# Altium project Flow_Pump.PrjPcb
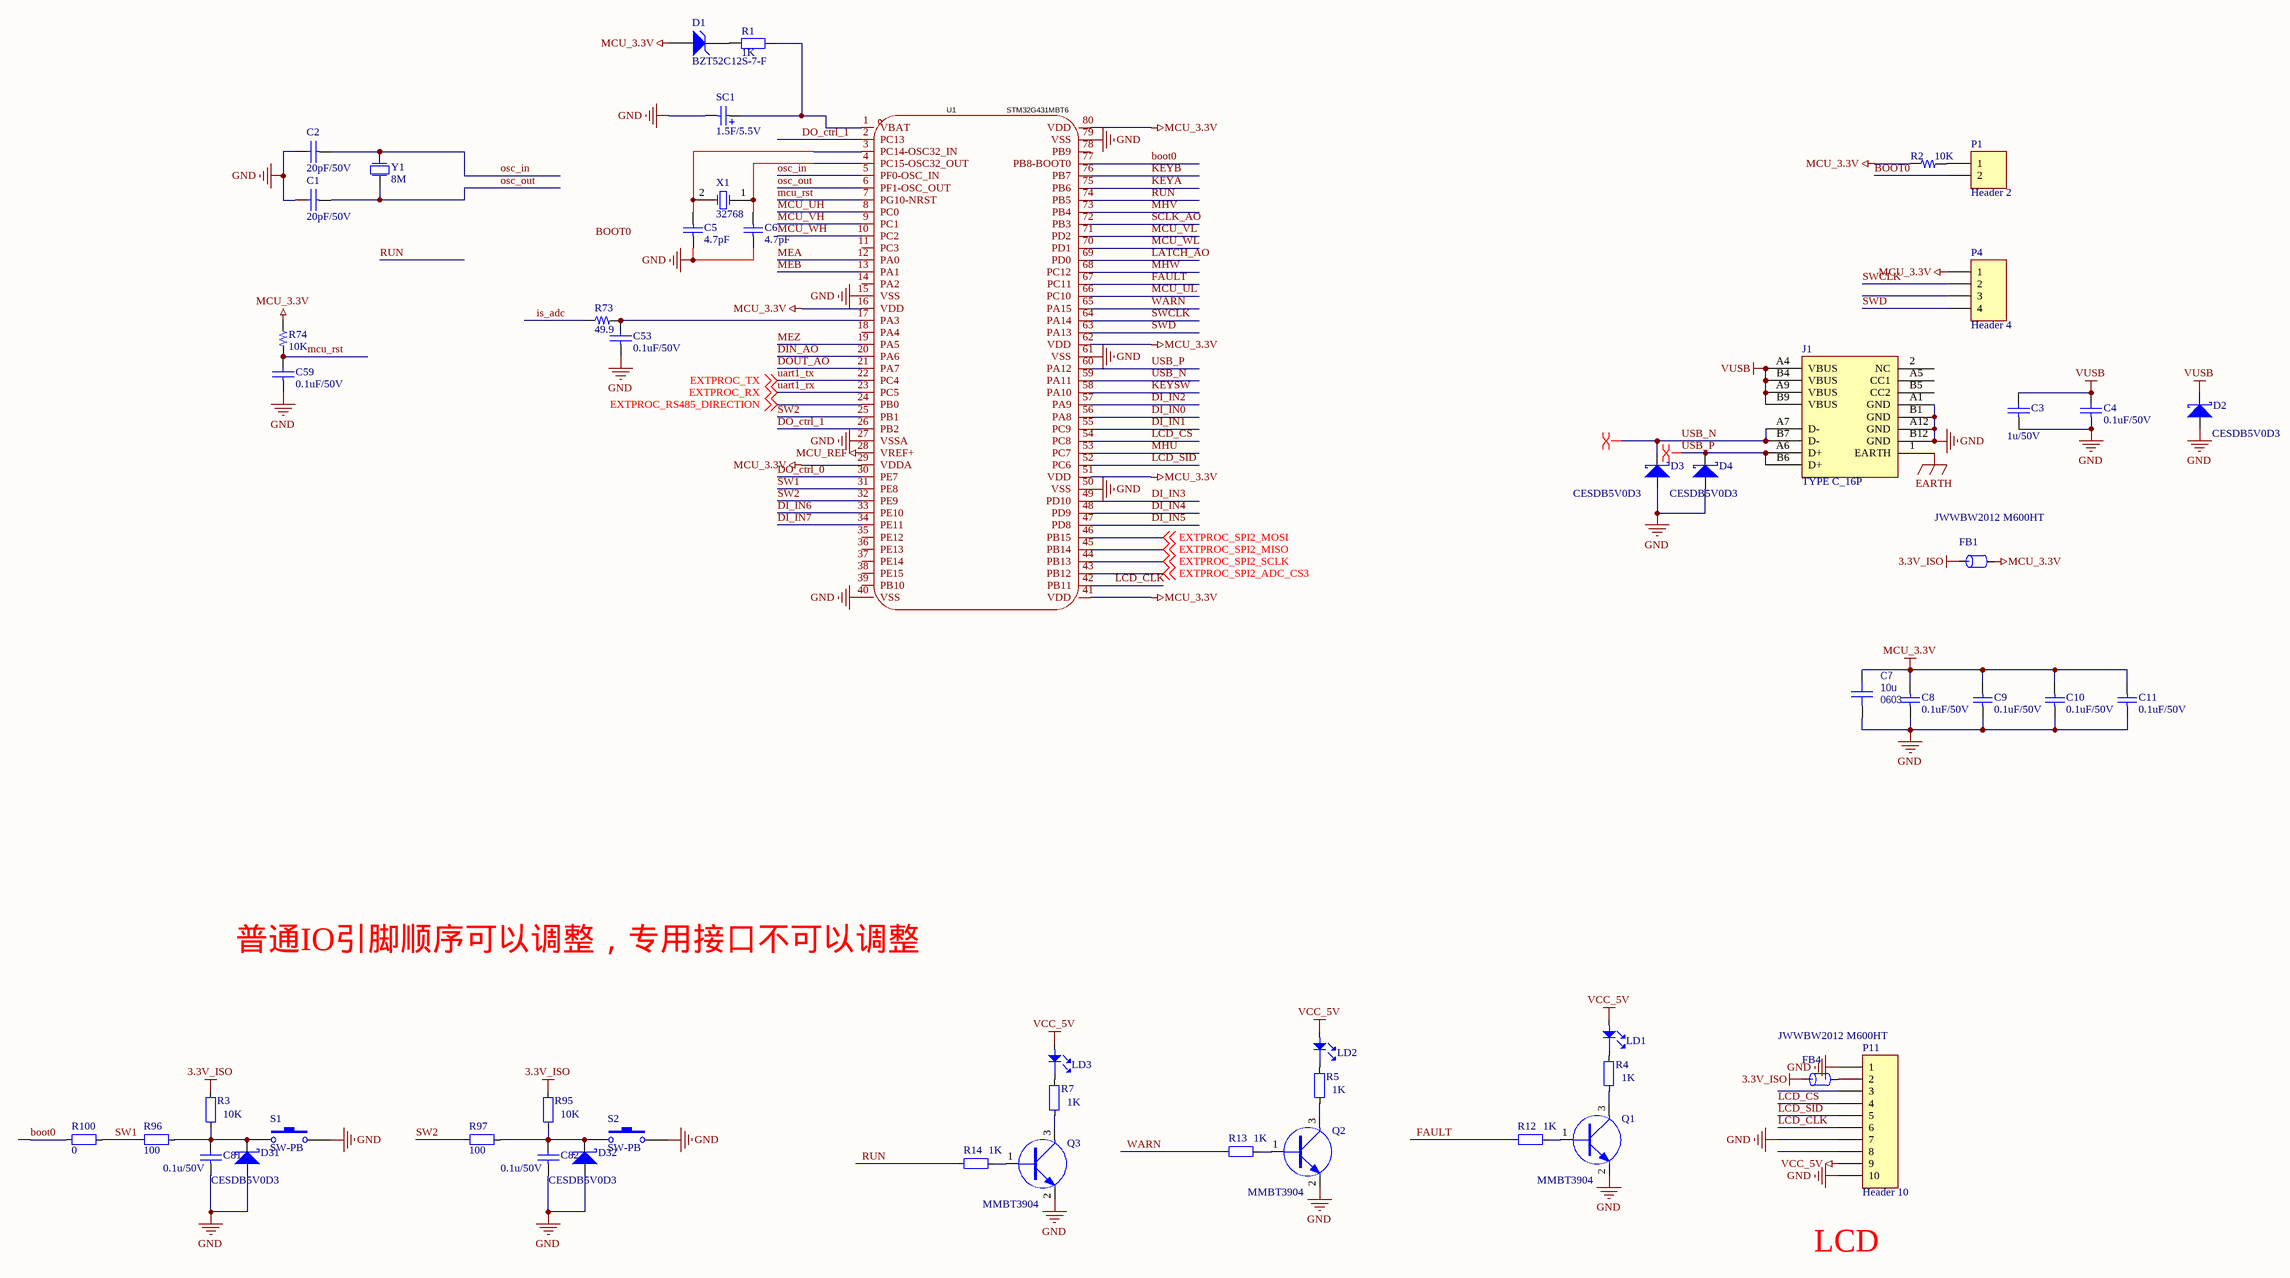
[diagram p0: mcu.SchDoc]
5 sheets, 247 parts. Net scope: global (net labels, ports and power ports of the same name join across sheets).
Board file: PCB1.PcbDoc
Sheets:
  mcu.SchDoc
  ai.SchDoc
  DI_DO.SchDoc
  sensor.SchDoc
  power.SchDoc

## Sheet mcu.SchDoc
size A2; SheetNumber: 1; SheetTotal: 4

### Parts
C1  value 20pF/50V  [0603C]  (hidden comment: 20pF/25V)
C2  value 20pF/50V  [0603C]  (hidden comment: 20pF/25V)
C3  value 1u/50V  [0603C]  (hidden comment: 1uF/25V)
C4  0.1uF/50V  [0603C]
C5  4.7pF  [0603C]
C6  4.7pF  [0603C]
C7  value 10u  Package: 0603  [CAPC1608X092N_0603]  (hidden comment: Capacitor_0603)
C8  0.1uF/50V  [0603C]
C9  0.1uF/50V  [0603C]
C10  0.1uF/50V  [0603C]
C11  0.1uF/50V  [0603C]
C53  0.1uF/50V  [0603C]
C59  0.1uF/50V  [0603C]
C81  value 0.1u/50V  [0603C]  (hidden comment: 1uF/25V)
C82  value 0.1u/50V  [0603C]  (hidden comment: 1uF/25V)
D1  BZT52C12S-7-F  [DIOD-SOD323-2_V]
D2  CESDB5V0D3  [SOD323]
D3  CESDB5V0D3  [SOD323]
D4  CESDB5V0D3  [SOD323]
D31  CESDB5V0D3  [SOD323]
D32  CESDB5V0D3  [SOD323]
FB1  JWWBW2012 M600HT  [0805R]
FB4  JWWBW2012 M600HT  [0805R]
J1  TYPE C_16P  [TYPEC_16P]
LD1  LED_Green_19-217  [0603led]  (value not drawn)
LD2  LED_Green_19-217  [0603led]  (value not drawn)
LD3  LED_Green_19-217  [0603led]  (value not drawn)
P1  Header 2  [HDR1X2]
P4  Header 4  [HDR1X4]
P11  Header 10  [HDR1X10]
Q1  MMBT3904  [SOT23-3]
Q2  MMBT3904  [SOT23-3]
Q3  MMBT3904  [SOT23-3]
R1  1K  [0603R]  (no BOM)
R2  10K  [0603R]
R3  10K  [0603r]
R4  1K  [0603r]
R5  1K  [0603r]
R7  1K  [0603r]
R12  1K  [0603r]
R13  1K  [0603r]
R14  1K  [0603r]
R73  49.9  [0603R]
R74  10K  [0603R]
R95  10K  [0603r]
R96  100  [0603r]
R97  100  [0603r]
R100  0  [0603r]
S1  SW-PB  [SPST-2]
S2  SW-PB  [SPST-2]
SC1  1.5F/5.5V  [CAP-TH_DMS3R3224]
U1  STM32G431MBT6  [LQFP-80_L12.0-W12.0-P0.50-BL-EP]
X1  32768  [A]
Y1  8M  [CRAY_5032]

### Nets
3.3V_ISO: FB1.1 FB4.1 R3.1 R95.1
EARTH: J1.1(EARTH)
GND: C1.2 C2.2 C3.1 C4.1 C5.2 C6.2 C7.2 C8.1 C9.1 C10.1 C11.1 C53.1 C59.1 C81.1 C82.1 D2.1(A) D3.1(A) D4.1(A) D31.1(A) D32.1(A) J1.A1(GND) J1.A12(GND) J1.B1(GND) J1.B12(GND) P11.1 P11.7 P11.10 Q1.2(E) Q2.2(E) Q3.2(E) S1.2 S2.2 SC1.2 U1.15(VSS) U1.27(VSSA) U1.40(VSS) U1.50(VSS) U1.61(VSS) U1.79(VSS)
MCU_3.3V: C7.1 C8.2 C9.2 C10.2 C11.2 D1.1(A) FB1.2 P4.1 R2.1 R74.1 U1.16(VDD) U1.29(VDDA) U1.41(VDD) U1.51(VDD) U1.62(VDD) U1.80(VDD)
MCU_REF: U1.28(VREF+)
VCC_5V: LD1.1 LD2.1 LD3.1 P11.9
VUSB: C3.2 C4.2 D2.2(K) J1.A4(VBUS) J1.A9(VBUS) J1.B4(VBUS) J1.B9(VBUS)
BOOT0: P1.2 R100.1 U1.77(PB8-BOOT0)
DI_IN0: U1.56(PA8)
DI_IN1: U1.55(PC9)
DI_IN2: U1.57(PA9)
DI_IN3: U1.49(PD10)
DI_IN4: U1.48(PD9)
DI_IN5: U1.47(PD8)
DI_IN6: U1.33(PE10)
DI_IN7: U1.34(PE11)
DIN_AO: U1.20(PA6)
DO_ctrl_0: U1.30(PE7)
DO_ctrl_1: U1.2(PC13) U1.26(PB2)
DOUT_AO: U1.21(PA7)
EXTPROC_RS485_DIRECTION: U1.24(PB0) ; off-sheet EXTPROC_RS485_DIRECTION
EXTPROC_SPI2_ADC_CS3: U1.43(PB12) ; off-sheet EXTPROC_SPI2_ADC_CS3
EXTPROC_SPI2_MISO: U1.45(PB14) ; off-sheet EXTPROC_SPI2_MISO
EXTPROC_SPI2_MOSI: U1.46(PB15) ; off-sheet EXTPROC_SPI2_MOSI
EXTPROC_SPI2_SCLK: U1.44(PB13) ; off-sheet EXTPROC_SPI2_SCLK
FAULT: R12.1 U1.67(PC11)
is_adc: R73.1
KEYA: U1.75(PB6)
KEYB: U1.76(PB7)
KEYSW: U1.58(PA10)
LATCH_AO: U1.69(PD0)
LCD_CLK: P11.6 U1.42(PB11)
LCD_CS: P11.4 U1.54(PC8)
LCD_SID: P11.5 U1.52(PC6)
mcu_rst: C59.2 R74.2 U1.7(PG10-NRST)
MCU_UH: U1.8(PC0)
MCU_UL: U1.66(PC10)
MCU_VH: U1.9(PC1)
MCU_VL: U1.71(PD2)
MCU_WH: U1.10(PC2)
MCU_WL: U1.70(PD1)
MEA: U1.12(PA0)
MEB: U1.13(PA1)
MEZ: U1.19(PA5)
MHU: U1.53(PC7)
MHV: U1.73(PB4)
MHW: U1.68(PC12)
osc_in: C2.1 U1.5(PF0-OSC_IN) Y1.1(P1)
osc_out: C1.1 U1.6(PF1-OSC_OUT) Y1.2(P2)
RUN: R14.1 U1.74(PB5)
SCLK_AO: U1.72(PB3)
SW1: R96.1 R100.2 U1.31(PE8)
SW2: R97.1 U1.25(PB1) U1.32(PE9)
SWCLK: P4.2 U1.64(PA14)
SWD: P4.4 U1.63(PA13)
uart1_rx: U1.23(PC5) ; off-sheet EXTPROC_RX  [also labelled EXTPROC_RX]
uart1_tx: U1.22(PC4) ; off-sheet EXTPROC_TX  [also labelled EXTPROC_TX]
USB_N: D3.2(K) J1.A7(D-) J1.B7(D-) U1.59(PA11)
USB_P: D4.2(K) J1.A6(D+) J1.B6(D+) U1.60(PA12)
WARN: R13.1 U1.65(PA15)
NetC5_1: C5.1 U1.3(PC14-OSC32_IN) X1.2(OSC2)
NetC6_1: C6.1 U1.4(PC15-OSC32_OUT) X1.1(OSC1)
NetC53_2: C53.2 R73.2 U1.17(PA3)
NetC81_2: C81.2 D31.2(K) R3.2 R96.2 S1.1
NetC82_2: C82.2 D32.2(K) R95.2 R97.2 S2.1
NetD1_2: D1.2(K) R1.1
NetFB4_2: FB4.2 P11.2
NetLD1_2: LD1.2 R4.1
NetLD2_2: LD2.2 R5.1
NetLD3_2: LD3.2 R7.1
NetP1_1: P1.1 R2.2
NetQ1_1: Q1.1(B) R12.2
NetQ1_3: Q1.3(C) R4.2
NetQ2_1: Q2.1(B) R13.2
NetQ2_3: Q2.3(C) R5.2
NetQ3_1: Q3.1(B) R14.2
NetQ3_3: Q3.3(C) R7.2
NetR1_2: R1.2 SC1.1 U1.1(VBAT)

Not connected (* = marked no-connect by the designer): J1 2(NC) A5(CC1) B5(CC2); P4 3; P11 3 8; U1 11(PC3) 14(PA2) 18(PA4) 35(PE12) 36(PE13) 37(PE14) 38(PE15) 39(PB10) 78(PB9)

### Layout directives
differential pair: USB_N, USB_P

### Notes on the sheet
- 普通IO引脚顺序可以调整，专用接口不可以调整
- LCD
- Labels drawn without touching a wire or pin: BOOT0

### Library data of the parts
C1-C4 C53 C59 C81 C82 = CAP
  C4 C53 C59: Value: 0.1uF/50V
C5 = Cap: Capacitor; Value: 6.8pF; Published: 8-Jun-2000; LatestRevisionDate: 17-Jul-2002; LatestRevisionNote: Re-released for DXP Platform.; PackageReference: RAD-0.3; Publisher: Altium Limited; PackageDescription: Radial Cap, Thru-Hole; 2 Leads; 0.3 in Pin Spacing
C6 = Cap: Capacitor; Published: 8-Jun-2000; LatestRevisionDate: 17-Jul-2002; LatestRevisionNote: Re-released for DXP Platform.; PackageReference: RAD-0.3; Publisher: Altium Limited; PackageDescription: Radial Cap, Thru-Hole; 2 Leads; 0.3 in Pin Spacing
C7 = Capacitor_0603: Capacitor, MLCC; Manufacturer: Murata Electronics; PartNumber: GRM188R61A106KE69D; Tolerance: [tol]; TempCo: [tempco]; Voltage Rating: [voltage]; Supplier 1: *; ComponentLink1URL: *; Supplier Part Number 1: *; ComponentLink1Description: Datasheet; SupplierDescription: CAP CER 10UF 10V X5R 0603
C8-C11 = Cap: Capacitor; Value: 22nF; Published: 8-Jun-2000; LatestRevisionDate: 17-Jul-2002; LatestRevisionNote: Re-released for DXP Platform.; PackageReference: RAD-0.3; Publisher: Altium Limited; PackageDescription: Radial Cap, Thru-Hole; 2 Leads; 0.3 in Pin Spacing
D1 = BZT52C12S-7-F: Zener Current: 5mA; Vz - Zener Voltage: 12V; Pd - Power Dissipation: 200mW; Zz - Zener Impedance: 40Ohms; Unit Weight: 0.000173oz; Voltage Temperature Coefficient: 0.25mV/C; Voltage Tolerance: 5%; Package Reference: SOD323-2; Minimum Operating Temperature: -65C; Packaging: Reel; Product Category: ZenerDiodes; Termination Style: SMD/SMT; Mounting Style: SMD/SMT; RoHS: True; Package / Case: SOD-323; Package Description: 2-Pin Surface Mount Device, Body 1.7 x 1.3 mm; Width: 1.4mm; Mounting Technology: SurfaceMount; Package URL: http://www.vishay.com/docs/71192/71192.pdf; Series: BZT52C12; Value: BZT52C12S-7-F
D2 D3 = DIODE S
D4 D31 D32 = DIODE S: Value: 0.1uF/50V
FB1 FB4 = FB: Part Field 1: 磁珠/0603/1K ohm/100MHz; FB: BLM18BD102SN1(muRata); Text Field1: FB
LD1-LD3 = LED_Green_19-217: 物料主编码(PN): 100000032; Value: 19-217/G7C-AN1P2/3T; ID: 6; 序号: 33; 物料名称: 绿色LED; 物料描述: Other,LED,绿色,0603,1.6X0.8X0.4mm,19-217/G7C-AN1P2/3T; 工作温度: –40°C to 85°C; 制造商: Everlight; 器件等级: ——; 物料类型: 特殊二极管; 规格型号(完整型号): 19-217/G7C-AN1P2/3T
P11 = Header 10: Header, 10-Pin; LatestRevisionDate: 17-Jul-2002; LatestRevisionNote: Re-released for DXP Platform.; Publisher: Altium Limited
Q1-Q3 = NPN_MMBT3904
R1 = Res0805M
R2 R73 R74 = R: Value: 10k/1%
R3 R95-R97 R100 = RES0603: 物料主编码(PN): 150000040; Value: 1K; ID: 233; 序号: 109; 物料名称: 贴片电阻; 精度: ±1%; 规格型号(完整型号): RC1608F103CS/RC0603FR-0710KL; 物料描述: RES,贴片电阻,0603,10k,±1%,1/10W,1.6X0.8X0.45mm,RC1608F103CS/RC0603FR-0710KL; 工作温度: –55°C to 155°C; 制造商: 三星/YAGEO; 器件等级: ——; 物料类型: 表贴电阻; 参数值: 1.00E+04
R4 R5 R7 R12-R14 = RES0603: 物料主编码(PN): 150000040; ID: 233; 序号: 109; 物料名称: 贴片电阻; 精度: ±1%; 规格型号(完整型号): RC1608F103CS/RC0603FR-0710KL; 物料描述: RES,贴片电阻,0603,10k,±1%,1/10W,1.6X0.8X0.45mm,RC1608F103CS/RC0603FR-0710KL; 工作温度: –55°C to 155°C; 制造商: 三星/YAGEO; 器件等级: ——; 物料类型: 表贴电阻; 参数值: 1.00E+04; Value: 1K
S1 S2 = SW-PB: Switch; Published: 24-Mar-1999; LatestRevisionDate: 17-Jul-2002; LatestRevisionNote: Re-released for DXP Platform.; PackageReference: SPST-2; Publisher: Altium Limited
SC1 = Cap Pol2: Polarized Capacitor (Axial); Value: 100pF; Published: 8-Jun-2000; LatestRevisionDate: 17-Jul-2002; LatestRevisionNote: Re-released for DXP Platform.; PackageReference: POLAR0.8; Publisher: Altium Limited
U1 = STM32G431MBT6: Add into BOM: yes; CPU Core: ARM-M4; Program Storage Size: 128KB; GPIO Ports Number: 66; Operating Voltage Range: 1.71V~3.6V; CPU Maximum Speed: 170MHz; ADC (Bit): 12bit; Symbol: STM32G431MBT6; Device: STM32G431MBT6; Supplier Part: C730099; Manufacturer: STM32G431MBT6; Manufacturer Part: STM32G431MBT6; Supplier Footprint: LQFP-80(12x12); JLCPCB Part Class: Extended Part; Datasheet: https://atta.szlcsc.com/upload/public/pdf/source/20200902/C730096_BFCD20E6BEC60EDD56B8D75B9D9F0D4C.pdf; Supplier: LCSC; Convert to PCB: yes; DAC (Bit): 12bit; Comment_1: STM32G431MBT6
X1 = XTAL: Crystal Oscillator; Published: 8-Jun-2000; LatestRevisionDate: 17-Jul-2002; LatestRevisionNote: Re-released for DXP Platform.; PackageReference: R38; Publisher: Altium Limited
Y1 = XTAL: Value: 8M
P1 = Header 2: Publisher: Altium Limited
P4 = Header 4: Publisher: Altium Limited

## Sheet ai.SchDoc
size A0; SheetNumber: 3; SheetTotal: 3
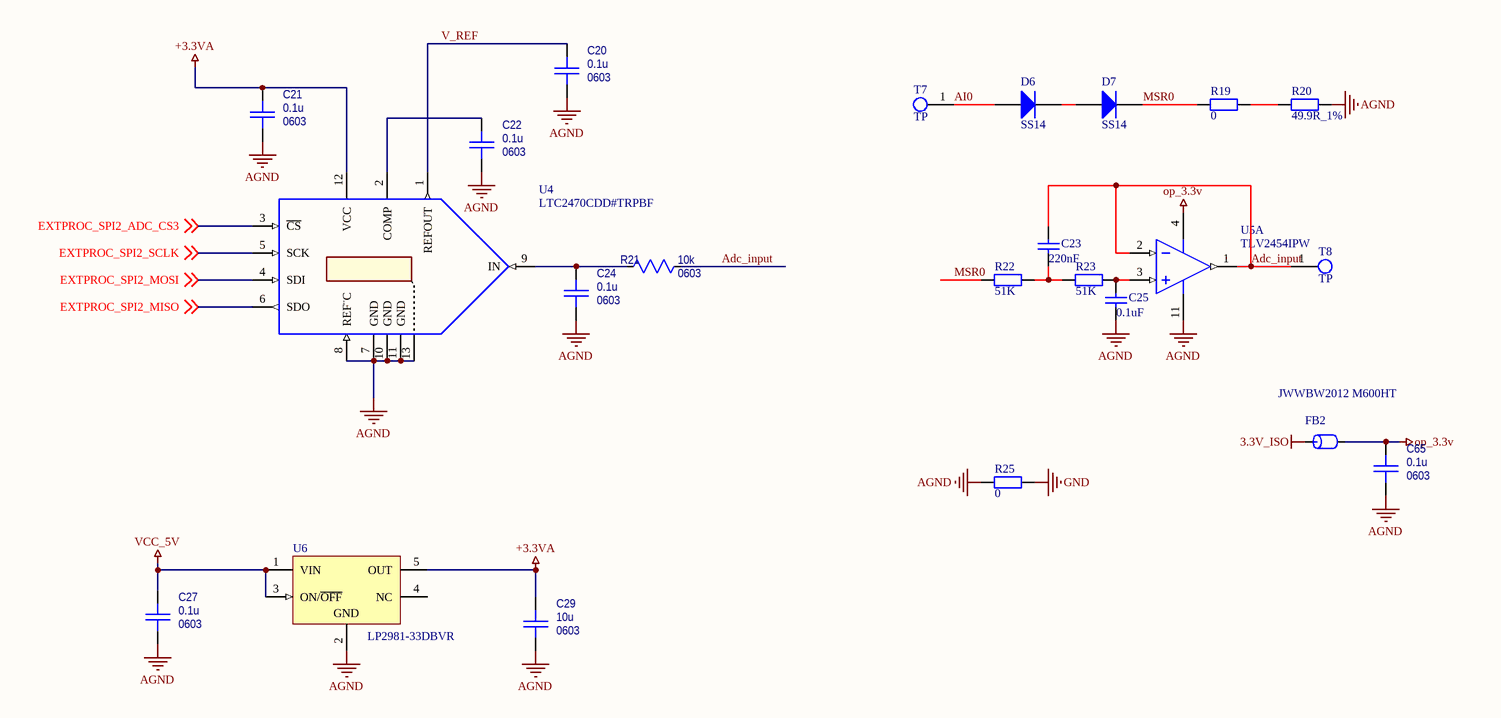
[diagram p1: ai.SchDoc]

### Parts
C20  value 0.1u  Package: 0603  [CAPC1608X092N_0603]  (hidden comment: Capacitor_0603)
C21  value 0.1u  Package: 0603  [CAPC1608X092N_0603]  (hidden comment: Capacitor_0603)
C22  value 0.1u  Package: 0603  [CAPC1608X092N_0603]  (hidden comment: Capacitor_0603)
C23  220nF  [0805C]
C24  value 0.1u  Package: 0603  [CAPC1608X092N_0603]  (hidden comment: Capacitor_0603)
C25  0.1uF  [0603C]
C27  value 0.1u  Package: 0603  [CAPC1608X092N_0603]  (hidden comment: Capacitor_0603)
C29  value 10u  Package: 0603  [CAPC1608X092N_0603]  (hidden comment: Capacitor_0603)
C65  value 0.1u  Package: 0603  [CAPC1608X092N_0603]  (hidden comment: Capacitor_0603)
D6  SS14  [DO-214AC]
D7  SS14  [DO-214AC]
FB2  JWWBW2012 M600HT  [0805R]
R19  0  [0805R]
R20  49.9R_1%  [0805R]
R21  value 10k  Package: 0603  [RESC1608X055N_0603]  (hidden comment: Resistor_0603)
R22  51K  [0603R]
R23  51K  [0603R]
R25  0  [1206R]
T7  TP  [TPD]
T8  TP  [TPD]
U4  LTC2470CDD#TRPBF  [LT-DD-12_V]
U5  TLV2454IPW  [TSSOP14]  (part A of 4)
U6  LP2981-33DBVR  [DBV0005A_M]

### Nets
3.3V_ISO: FB2.1
+3.3VA: C21.1 C29.1 U4.12(VCC) U6.5(OUT)
AGND: C20.2 C21.2 C22.2 C24.2 C25.1 C27.2 C29.2 C65.2 R20.1 R25.2 U4.7(GND) U4.8(REF¨C) U4.10(GND) U4.11(GND) U4.13(EP) U5.11(GND) U6.2(GND)
GND: R25.1
op_3.3v: C65.1 FB2.2 U5.4(V+)
VCC_5V: C27.1 U6.1(VIN) U6.3(ON/~{OFF})
Adc_input: C23.2 R21.1 T8.1 U5.1(OUT) U5.2(IN-)
AI0: D6.1(A) T7.1
EXTPROC_SPI2_ADC_CS3: U4.3(~{CS}) ; off-sheet EXTPROC_SPI2_ADC_CS3
EXTPROC_SPI2_MISO: U4.6(SDO) ; off-sheet EXTPROC_SPI2_MISO
EXTPROC_SPI2_MOSI: U4.4(SDI) ; off-sheet EXTPROC_SPI2_MOSI
EXTPROC_SPI2_SCLK: U4.5(SCK) ; off-sheet EXTPROC_SPI2_SCLK
MSR0: D7.2(K) R19.2 R22.2
V_REF: C20.1 U4.1(REFOUT)
NetC22_1: C22.1 U4.2(COMP)
NetC23_1: C23.1 R22.1 R23.2
NetC24_1: C24.1 R21.2 U4.9(IN)
NetC25_2: C25.2 R23.1 U5.3(IN+)
NetD6_2: D6.2(K) D7.1(A)
NetR19_1: R19.1 R20.2

Not connected (* = marked no-connect by the designer): U6 4(NC)

### Library data of the parts
C20-C22 C24 C27 C65 = Capacitor_0603: Capacitor, MLCC; PartNumber: C0603C104M5RACTU; Tolerance: [tol]; TempCo: [tempco]; Voltage Rating: [voltage]; ComponentLink1URL: *; ComponentLink1Description: Datasheet; SupplierDescription: CAP CER 0.1UF 50V X7R 0603
C23 C25 = Cap: Capacitor; Published: 8-Jun-2000; LatestRevisionDate: 17-Jul-2002; LatestRevisionNote: Re-released for DXP Platform.; PackageReference: RAD-0.3; Publisher: Altium Limited; PackageDescription: Radial Cap, Thru-Hole; 2 Leads; 0.3 in Pin Spacing
C29 = Capacitor_0603: Capacitor, MLCC; PartNumber: GRM188R61A106KE69D; Tolerance: [tol]; TempCo: [tempco]; Voltage Rating: [voltage]; ComponentLink1URL: *; ComponentLink1Description: Datasheet; SupplierDescription: CAP CER 10UF 10V X5R 0603
D6 D7 = Diode: Default Diode; Published: 8-Jun-2000; LatestRevisionDate: 17-Jul-2002; LatestRevisionNote: Re-released for DXP Platform.; PackageVersion: Sep-1996; PackageReference: SMC; Publisher: Altium Limited; Code_JEDEC: DO-214-AB
FB2 = FB: as FB1 on sheet mcu; Text Field1: FB
R19 R20 R22 R23 R25 = Res0805M
R21 = Resistor_0603: Resistor, Standard; PartNumber: RR0816P-103-D; TempCo: [tempco]; Tolerance: tol; ComponentLink1URL: *; ComponentLink1Description: Datasheet; SupplierDescription: RES SMD 10K OHM 0.5% 1/16W 0603
U4 = LTC2470CDD#TRPBF: 16-bit Analog-to-digital Converters, 12-pin SON (DD-12), 0 to 70 degC, Pb-Free, Tape and Reel; PartNumber: LTC2470CDD#TRPBF; ComponentLink2URL: https://www.analog.com/media/en/technical-documentation/data-sheets/24702fb.pdf; ComponentLink1URL: http://www.linear.com/; ComponentLink2Description: Datasheet; ComponentLink1Description: Manufacturer URL; Value: LTC2470CDD#TRPBF
U5 = MAX908EPD: Quad High-speed, Ultra Low-power, Single-Supply TTL comparator; Published: 16-Jan-2001; LatestRevisionDate: 29-May-2009; LatestRevisionNote: Component Body Added.; DatasheetVersion: Jul-1994; PackageVersion: RevB, 21-0043; PackageReference: PD14; Publisher: Altium Limited; PackageDescription: DIP, 14-Pin, Row Spacing 7.62 mm, Pitch 2.54 mm; Code_JEDEC: MS-001-AC; ComponentLink1Description: Manufacturer Link; ComponentLink1URL: http://www.maxim-ic.com/; ComponentLink2Description: Datasheet; ComponentLink2URL: http://pdfserv.maxim-ic.com/en/ds/MAX907-MAX909.pdf
U6 = LP2981-33DBVR: Micropower 100 mA Ultra Low-Dropout Regulator, 5-pin SOT-23, Pb-Free; ComponentLink1URL: http://www.ti.com/general/docs/lit/getliterature.tsp?genericPartNumber=LP2981-N&fileType=pdf; ComponentLink1Description: Datasheet URL; Value: LP2981-33DBVR

## Sheet DI_DO.SchDoc
size A3; SheetNumber: 4; SheetTotal: 4
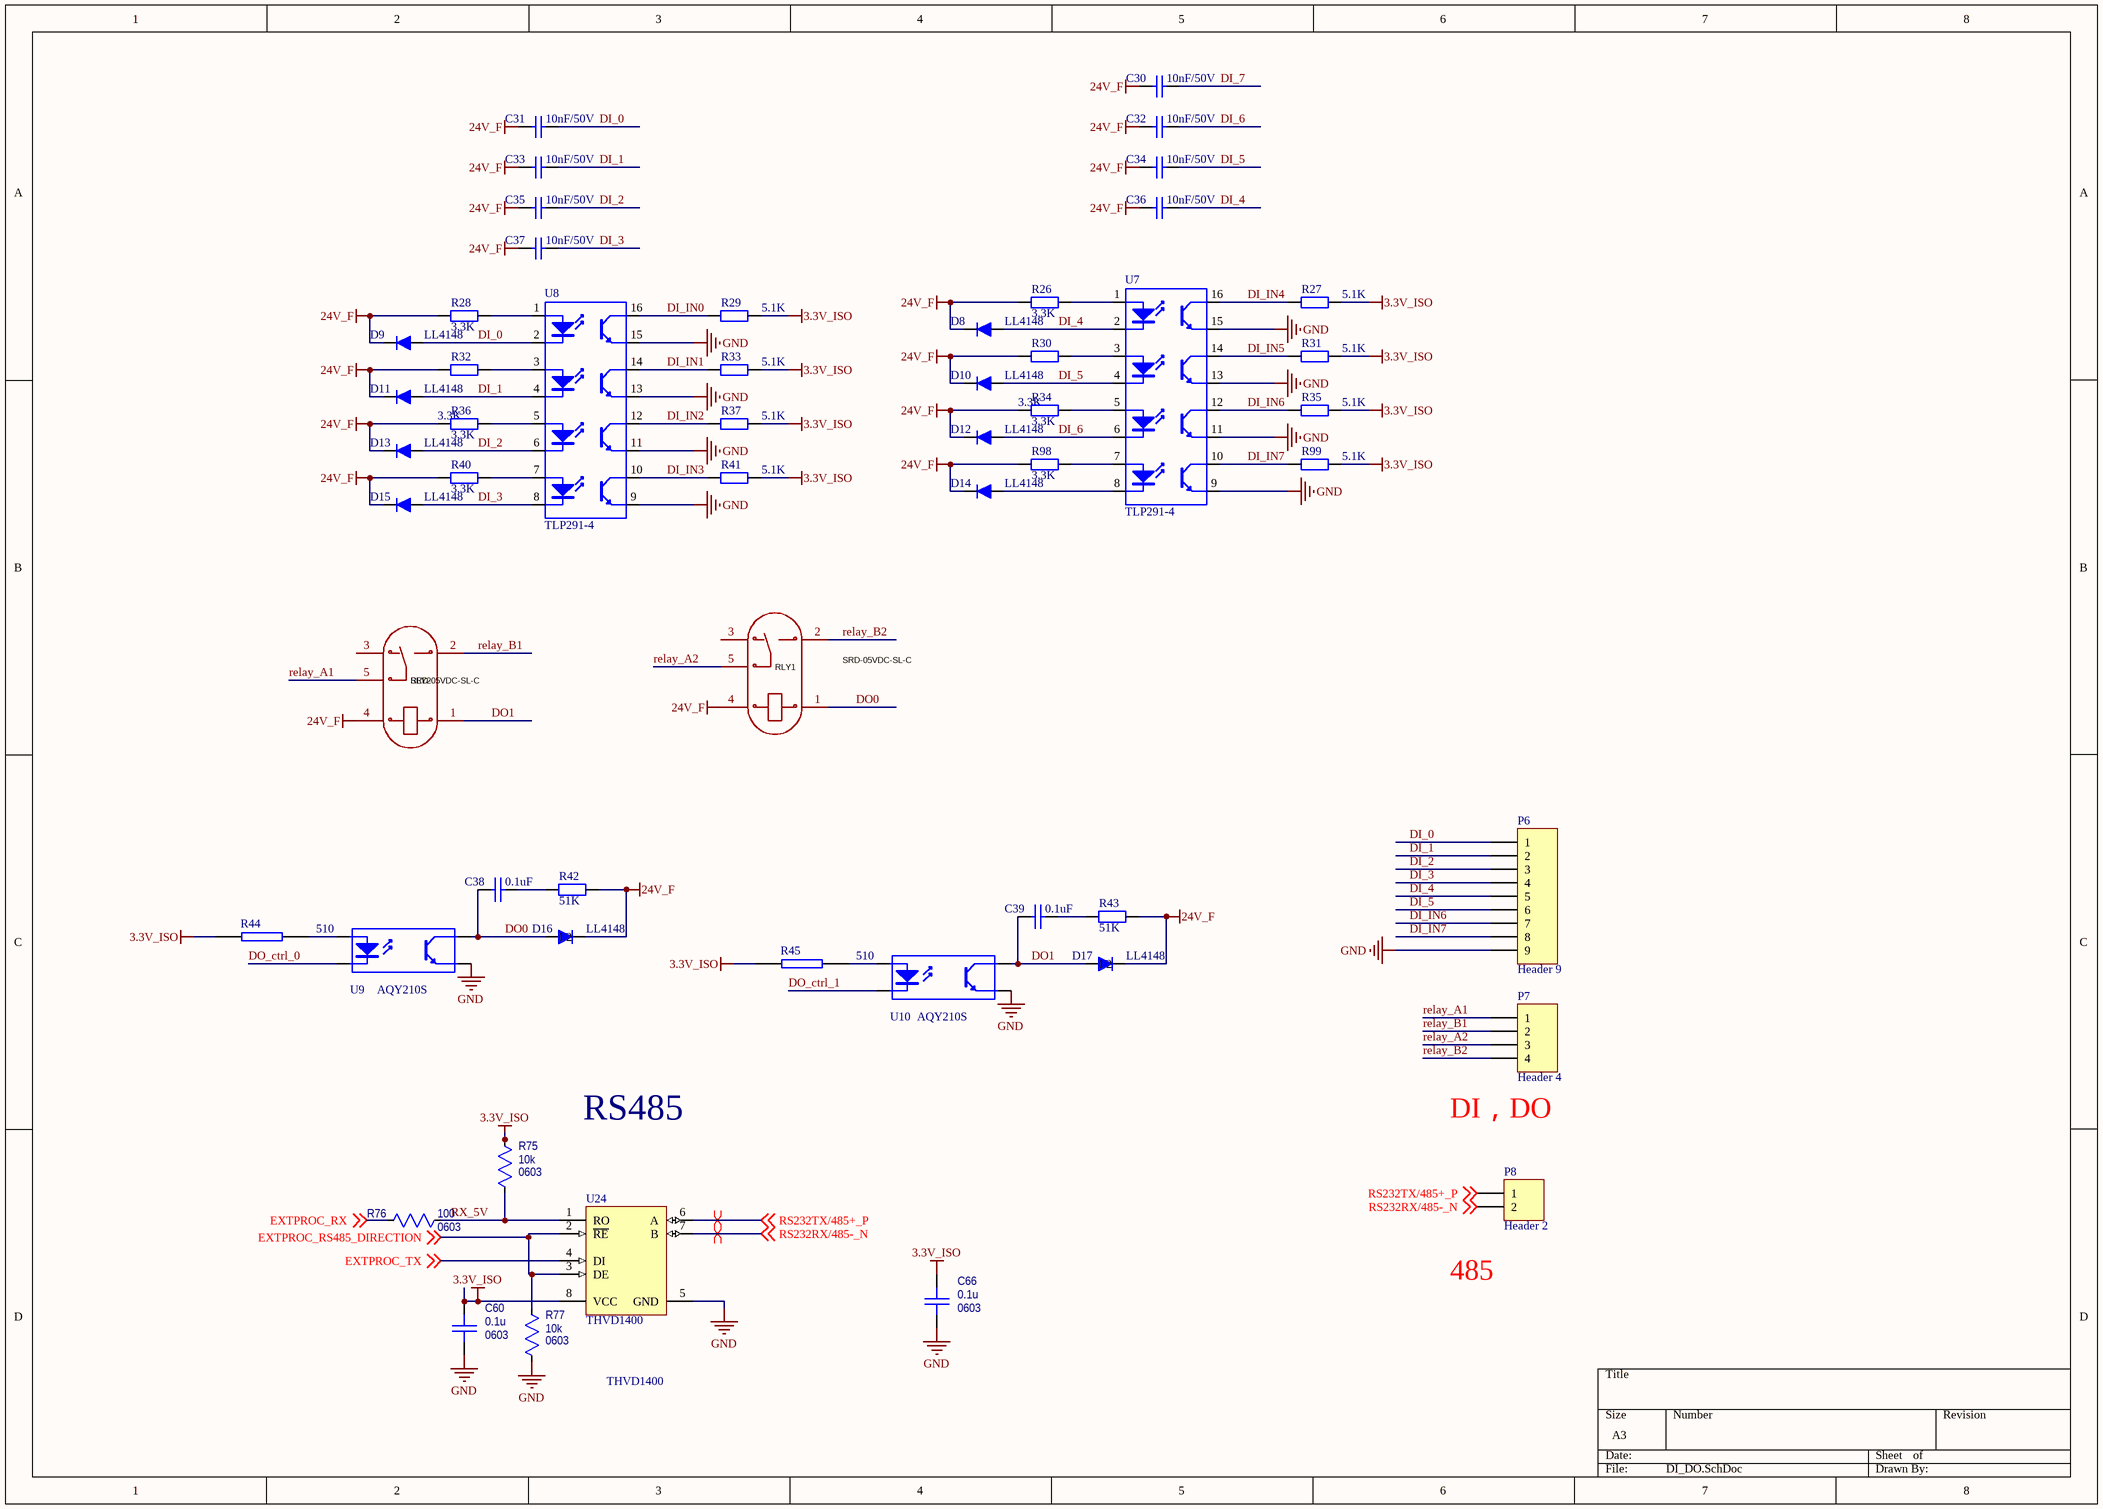
[diagram p2: DI_DO.SchDoc]

### Parts
C30  10nF/50V  [0603C]
C31  10nF/50V  [0603C]
C32  10nF/50V  [0603C]
C33  10nF/50V  [0603C]
C34  10nF/50V  [0603C]
C35  10nF/50V  [0603C]
C36  10nF/50V  [0603C]
C37  10nF/50V  [0603C]
C38  0.1uF  [0603C]
C39  0.1uF  [0603C]
C60  value 0.1u  Package: 0603  [CAPC1608X092N_0603]  (hidden comment: Capacitor_0603)
C66  value 0.1u  Package: 0603  [CAPC1608X092N_0603]  (hidden comment: Capacitor_0603)
D8  LL4148  [DO-213AB/LL34/MiniMELF]
D9  LL4148  [DO-213AB/LL34/MiniMELF]
D10  LL4148  [DO-213AB/LL34/MiniMELF]
D11  LL4148  [DO-213AB/LL34/MiniMELF]
D12  LL4148  [DO-213AB/LL34/MiniMELF]
D13  LL4148  [DO-213AB/LL34/MiniMELF]
D14  LL4148  [DO-213AB/LL34/MiniMELF]
D15  LL4148  [DO-213AB/LL34/MiniMELF]
D16  LL4148  [DO-213AB/LL34/MiniMELF]
D17  LL4148  [DO-213AB/LL34/MiniMELF]
P6  Header 9  [HDR1X9]
P7  Header 4  [HDR1X4]
P8  Header 2  [HDR1X2]
R26  3.3K  [0603R]
R27  5.1K  [0603R]
R28  3.3K  [0603R]
R29  5.1K  [0603R]
R30  3.3K  [0603R]
R31  5.1K  [0603R]
R32  3.3K  [0603R]
R33  5.1K  [0603R]
R34  3.3K  [0603R]
R35  5.1K  [0603R]
R36  3.3K  [0603R]
R37  5.1K  [0603R]
R40  3.3K  [0603R]
R41  5.1K  [0603R]
R42  51K  [0603R]
R43  51K  [0603R]
R44  510  [0603R]
R45  510  [0603R]
R75  value 10k  Package: 0603  [RESC1608X055N_0603]  (hidden comment: Resistor_0603)
R76  value 100  Package: 0603  [RESC1608X055N_0603]  (hidden comment: Resistor_0603)
R77  value 10k  Package: 0603  [RESC1608X055N_0603]  (hidden comment: Resistor_0603)
R98  3.3K  [0603R]
R99  5.1K  [0603R]
RLY1  SRD-05VDC-SL-C  [RELAY-TH_SRD-XXVDC-XL-C]
RLY2  SRD-05VDC-SL-C  [RELAY-TH_SRD-XXVDC-XL-C]
U7  TLP291-4  [SOP16-T]
U8  TLP291-4  [SOP16-T]
U9  AQY210S  [sop4]
U10  AQY210S  [sop4]
U24  THVD1400  [MAXM-S8+4_M]

### Nets
3.3V_ISO: C60.1 C66.1 R27.1 R29.1 R31.1 R33.1 R35.1 R37.1 R41.1 R44.2 R45.2 R75.2 R99.1 U24.8(VCC)
24V_F: C30.1 C31.1 C32.1 C33.1 C34.1 C35.1 C36.1 C37.1 D8.2 D9.2 D10.2 D11.2 D12.2 D13.2 D14.2 D15.2 D16.2(1) D17.2(1) R26.2 R28.2 R30.2 R32.2 R34.2 R36.2 R40.2 R42.2 R43.2 R98.2 RLY1.4 RLY2.4
GND: C60.2 C66.2 P6.9 R77.1 U7.9(E) U7.11(E) U7.13(E) U7.15(E) U8.9(E) U8.11(E) U8.13(E) U8.15(E) U9.3(E) U10.3(E) U24.5(GND)
DI_0: C31.2 D9.1 P6.1 U8.2(K)
DI_1: C33.2 D11.1 P6.2 U8.4(K)
DI_2: C35.2 D13.1 P6.3 U8.6(K)
DI_3: C37.2 D15.1 P6.4 U8.8(K)
DI_4: C36.2 D8.1 P6.5 U7.2(K)
DI_5: C34.2 D10.1 P6.6 U7.4(K)
DI_6: C32.2 D12.1 U7.6(K)
DI_7: C30.2
DI_IN0: R29.2 U8.16(C)
DI_IN1: R33.2 U8.14(C)
DI_IN2: R37.2 U8.12(C)
DI_IN3: R41.2 U8.10(C)
DI_IN4: R27.2 U7.16(C)
DI_IN5: R31.2 U7.14(C)
DI_IN6: P6.7 R35.2 U7.12(C)
DI_IN7: P6.8 R99.2 U7.10(C)
DO0: C38.1 D16.1(2) RLY1.1 U9.4(C)
DO1: C39.1 D17.1(2) RLY2.1 U10.4(C)
DO_ctrl_0: U9.2(K)
DO_ctrl_1: U10.2(K)
EXTPROC_RS485_DIRECTION: R77.2 U24.2(~{RE}) U24.3(DE) ; off-sheet EXTPROC_RS485_DIRECTION
EXTPROC_RX: R76.2 ; off-sheet EXTPROC_RX  [project net uart1_rx]
EXTPROC_TX: U24.4(DI) ; off-sheet EXTPROC_TX  [project net uart1_tx]
relay_A1: P7.1 RLY2.5
relay_A2: P7.3 RLY1.5
relay_B1: P7.2 RLY2.2
relay_B2: P7.4 RLY1.2
RS232RX/485-_N: P8.2 U24.7(B) ; off-sheet RS232RX/485-_N
RS232TX/485+_P: P8.1 U24.6(A) ; off-sheet RS232TX/485+_P
RX_5V: R75.1 R76.1 U24.1(RO)
NetC38_2: C38.2 R42.1
NetC39_2: C39.2 R43.1
NetD14_1: D14.1 U7.8(K)
NetR26_1: R26.1 U7.1(A)
NetR28_1: R28.1 U8.1(A)
NetR30_1: R30.1 U7.3(A)
NetR32_1: R32.1 U8.3(A)
NetR34_1: R34.1 U7.5(A)
NetR36_1: R36.1 U8.5(A)
NetR40_1: R40.1 U8.7(A)
NetR44_1: R44.1 U9.1(A)
NetR45_1: R45.1 U10.1(A)
NetR98_1: R98.1 U7.7(A)

Not connected (* = marked no-connect by the designer): RLY1 3; RLY2 3

### Layout directives
differential pair: RS232RX/485-_N, RS232TX/485+_P

### Notes on the sheet
- RS485
- (near P7) DI，DO
- (near P8) 485
- THVD1400

### Library data of the parts
C30-C37 = Cap: Capacitor; Value: 22nF; Published: 8-Jun-2000; LatestRevisionDate: 17-Jul-2002; LatestRevisionNote: Re-released for DXP Platform.; PackageReference: RAD-0.3; Publisher: Altium Limited; PackageDescription: Radial Cap, Thru-Hole; 2 Leads; 0.3 in Pin Spacing
C38 C39 = CAP: Capacitor
C60 C66 = Capacitor_0603: as C20 on sheet ai; ComponentLink1URL: *; ComponentLink1Description: Datasheet; SupplierDescription: CAP CER 0.1UF 50V X7R 0603
D8-D17 = LL4148: VISHAY,LL4148,圆柱体MiniMELF100V/2A,ROHS; 版本: V1.00; 名称: 快速开关二极管; 物料编号: APLLY; 制造商: VISHAY
P6 = Header 9: Header, 9-Pin; LatestRevisionDate: 17-Jul-2002; LatestRevisionNote: Re-released for DXP Platform.; Publisher: Altium Limited
P7 = Header 4: Header, 4-Pin; LatestRevisionDate: 17-Jul-2002; LatestRevisionNote: Re-released for DXP Platform.; Publisher: Altium Limited
P8 = Header 2: Header, 2-Pin; LatestRevisionDate: 17-Jul-2002; LatestRevisionNote: Re-released for DXP Platform.; Publisher: Altium Limited
R26-R37 R40-R43 R98 R99 = Res0805M
R44 R45 = RES2
R75 R77 = Resistor_0603: Resistor, Standard; PartNumber: RC0603FR-0710KL; TempCo: [tempco]; Tolerance: tol; ComponentLink1URL: *; ComponentLink1Description: Datasheet; SupplierDescription: RES SMD 10K OHM 1% 1/10W 0603
R76 = Resistor_0603: Resistor, Standard; PartNumber: RC0603FR-07100RL; TempCo: [tempco]; Tolerance: tol; ComponentLink1URL: *; ComponentLink1Description: Datasheet; SupplierDescription: RES SMD 100 OHM 1% 1/10W 0603
RLY1 RLY2 = SRD-05VDC-SL-C: Manufacturer: 松乐; Add into BOM: yes; Coil Voltage: 5V; Contact Form: 一组转换:1C(单刀双掷-转换); Pin Number: 5; Maximum Switching Voltage: 250V@AC; Coil Rated Power: 360mW; Maximum Switching Current: 15A; Coil Type: 无极性-单线圈; Coil Resistance: 70Ω; Contact Resistance: 100mΩ; Operate Time: 10ms; Symbol: SRD-05VDC-SL-C; Device: SRD-05VDC-SL-C; LCSC Part Name: 蓝色; Supplier Part: C35449; Manufacturer Part: SRD-05VDC-SL-C; Supplier Footprint: 插件,15.6x19.2mm; JLCPCB Part Class: Extended Part; Datasheet: https://atta.szlcsc.com/upload/public/pdf/source/20200305/C490149_C96E4098A3B1FFB377D5AD2E40B7C2A8.pdf; Supplier: LCSC; Convert to PCB: yes; Contact Rating: -; Release Time: 10ms
U7 U8 = TLP281-4
U9 U10 = Optoisolator1: 4-Pin Phototransistor Optocoupler; Published: 24-Mar-1999; LatestRevisionDate: 04-Mar-2005; LatestRevisionNote: Sch pins 3 & 4 Swapped.; DatasheetVersion: Nov-2003; PackageReference: DIP-4; Publisher: Altium Limited
U24 = MAX33071EASA+: RS-485 Half-Duplex Transceiver with ±65V Fault Protection,+3V to +5.5V, -40 to 125 degC, 8-Pin SOIC (S8+4), RoHS, Tube; VOUT: 3.000 V; VIN: 3.2 to 12.6 V; PartNumber: MAX33071EASA+; ComponentLink1URL: http://www.maximintegrated.com/; ComponentLink1Description: Manufacturer URL; ComponentLink2URL: https://datasheets.maximintegrated.com/en/ds/MAX33070E-MAX33071E.pdf; ComponentLink2Description: Datasheet; Value: MAX33071EASA+

## Sheet sensor.SchDoc
size A3
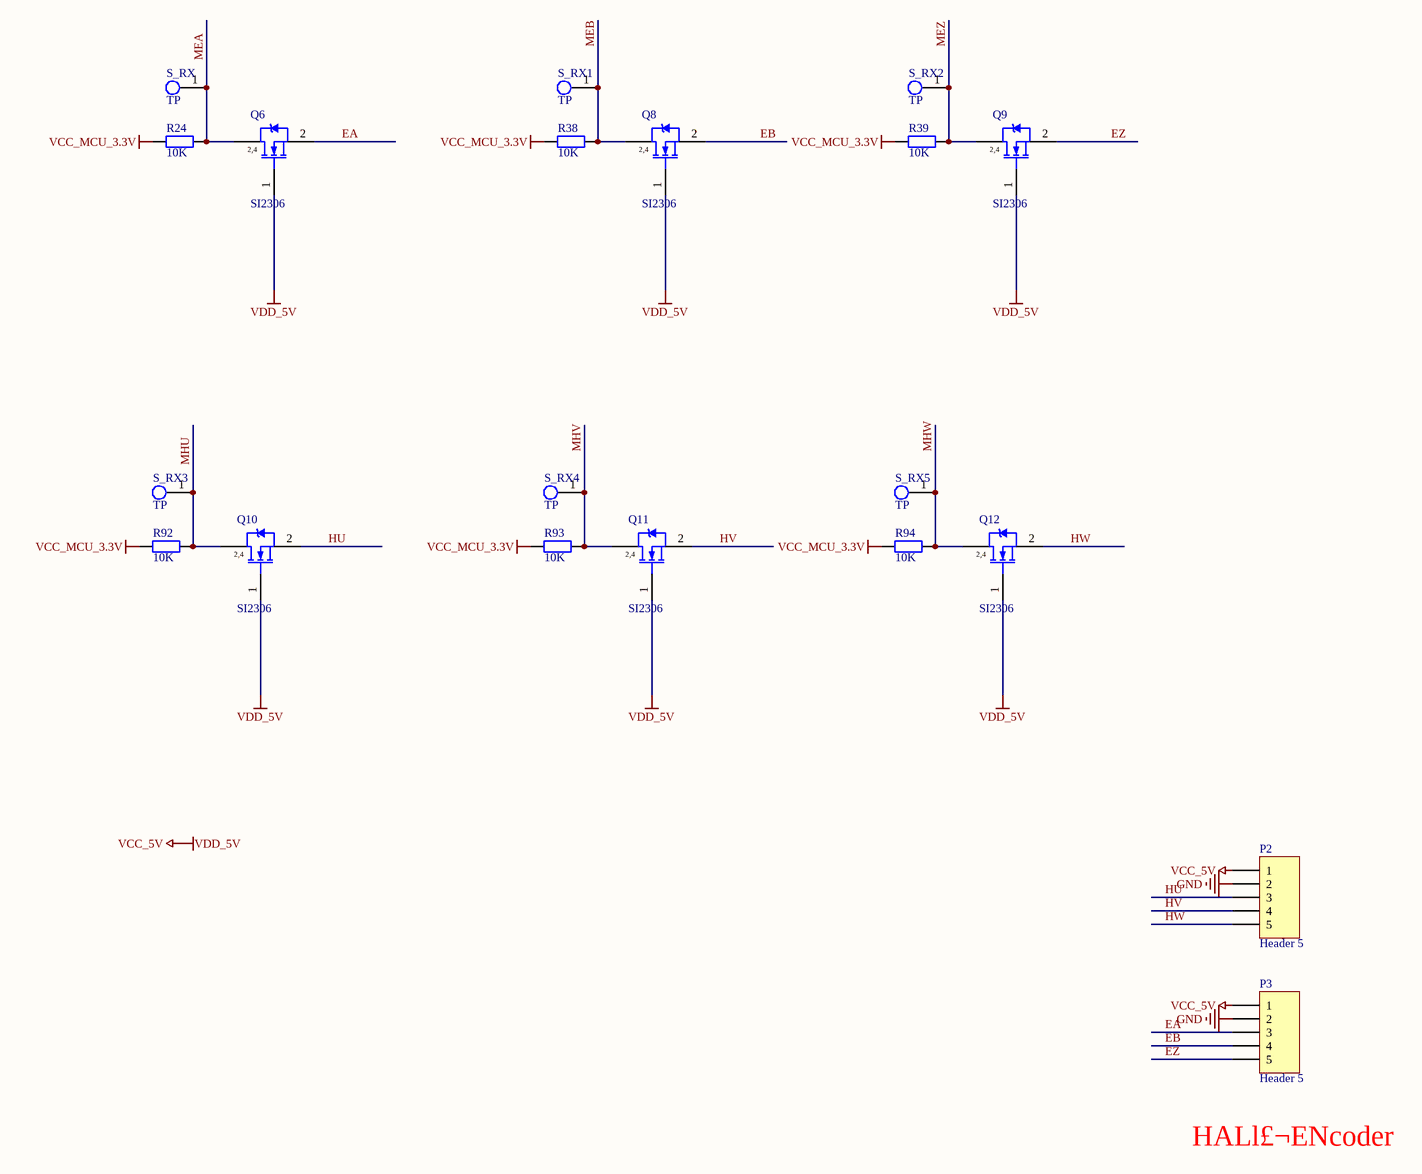
[diagram p3: sensor.SchDoc]

### Parts
P2  Header 5  [HDR1X5]
P3  Header 5  [HDR1X5]
Q6  SI2306  [SOT23-3]
Q8  SI2306  [SOT23-3]
Q9  SI2306  [SOT23-3]
Q10  SI2306  [SOT23-3]
Q11  SI2306  [SOT23-3]
Q12  SI2306  [SOT23-3]
R24  10K  [0603R]
R38  10K  [0603R]
R39  10K  [0603R]
R92  10K  [0603R]
R93  10K  [0603R]
R94  10K  [0603R]
S_RX  TP  [TPD]
S_RX1  TP  [TPD]
S_RX2  TP  [TPD]
S_RX3  TP  [TPD]
S_RX4  TP  [TPD]
S_RX5  TP  [TPD]

### Nets
GND: P2.2 P3.2
VCC_5V: P2.1 P3.1 Q6.1(G) Q8.1(G) Q9.1(G) Q10.1(G) Q11.1(G) Q12.1(G)  [also labelled VDD_5V]
VCC_MCU_3.3V: R24.1 R38.1 R39.1 R92.1 R93.1 R94.1
EA: P3.3 Q6.2(S)
EB: P3.4 Q8.2(S)
EZ: P3.5 Q9.2(S)
HU: P2.3 Q10.2(S)
HV: P2.4 Q11.2(S)
HW: P2.5 Q12.2(S)
MEA: Q6.3(D) R24.2 S_RX.1
MEB: Q8.3(D) R38.2 S_RX1.1
MEZ: Q9.3(D) R39.2 S_RX2.1
MHU: Q10.3(D) R92.2 S_RX3.1
MHV: Q11.3(D) R93.2 S_RX4.1
MHW: Q12.3(D) R94.2 S_RX5.1

### Notes on the sheet
- HALl£¬ENcoder
- (in symbol BUK92150-55A) 2,4

### Library data of the parts
P2 P3 = Header 5: Header, 5-Pin; LatestRevisionDate: 17-Jul-2002; LatestRevisionNote: Re-released for DXP Platform.; Publisher: Altium Limited
Q6 Q8-Q12 = BUK92150-55A: Published: 8-Jun-2000; LatestRevisionDate: 17-Jul-2002; LatestRevisionNote: Re-released for DXP Platform.; DatasheetVersion: 6-Oct-1997; PackageVersion: Aug-1998; PackageReference: TSOP-6; Publisher: Altium Limited; PackageDescription: SOT-457/SC-74; 6 Leads; Body 3.1 x 3 mm, inc. leads (LxW max); ComponentLink1Description: Manufacturer Link; ComponentLink1URL: http://www.vishay.com/; ComponentLink2Description: Datasheet; ComponentLink2URL: http://www.vishay.com/docs/70192/70192.pdf
R24 R38 R39 R92-R94 = Res2: Resistor; Value: 10R; Published: 8-Jun-2000; LatestRevisionDate: 17-Jul-2002; LatestRevisionNote: Re-released for DXP Platform.; PackageReference: AXIAL-0.4; Publisher: Altium Limited

## Sheet power.SchDoc
size A2; SPICEModelCacheUWPXBFBI: <root> / <DocumentId>UWPXBFBI</DocumentId> / </root>
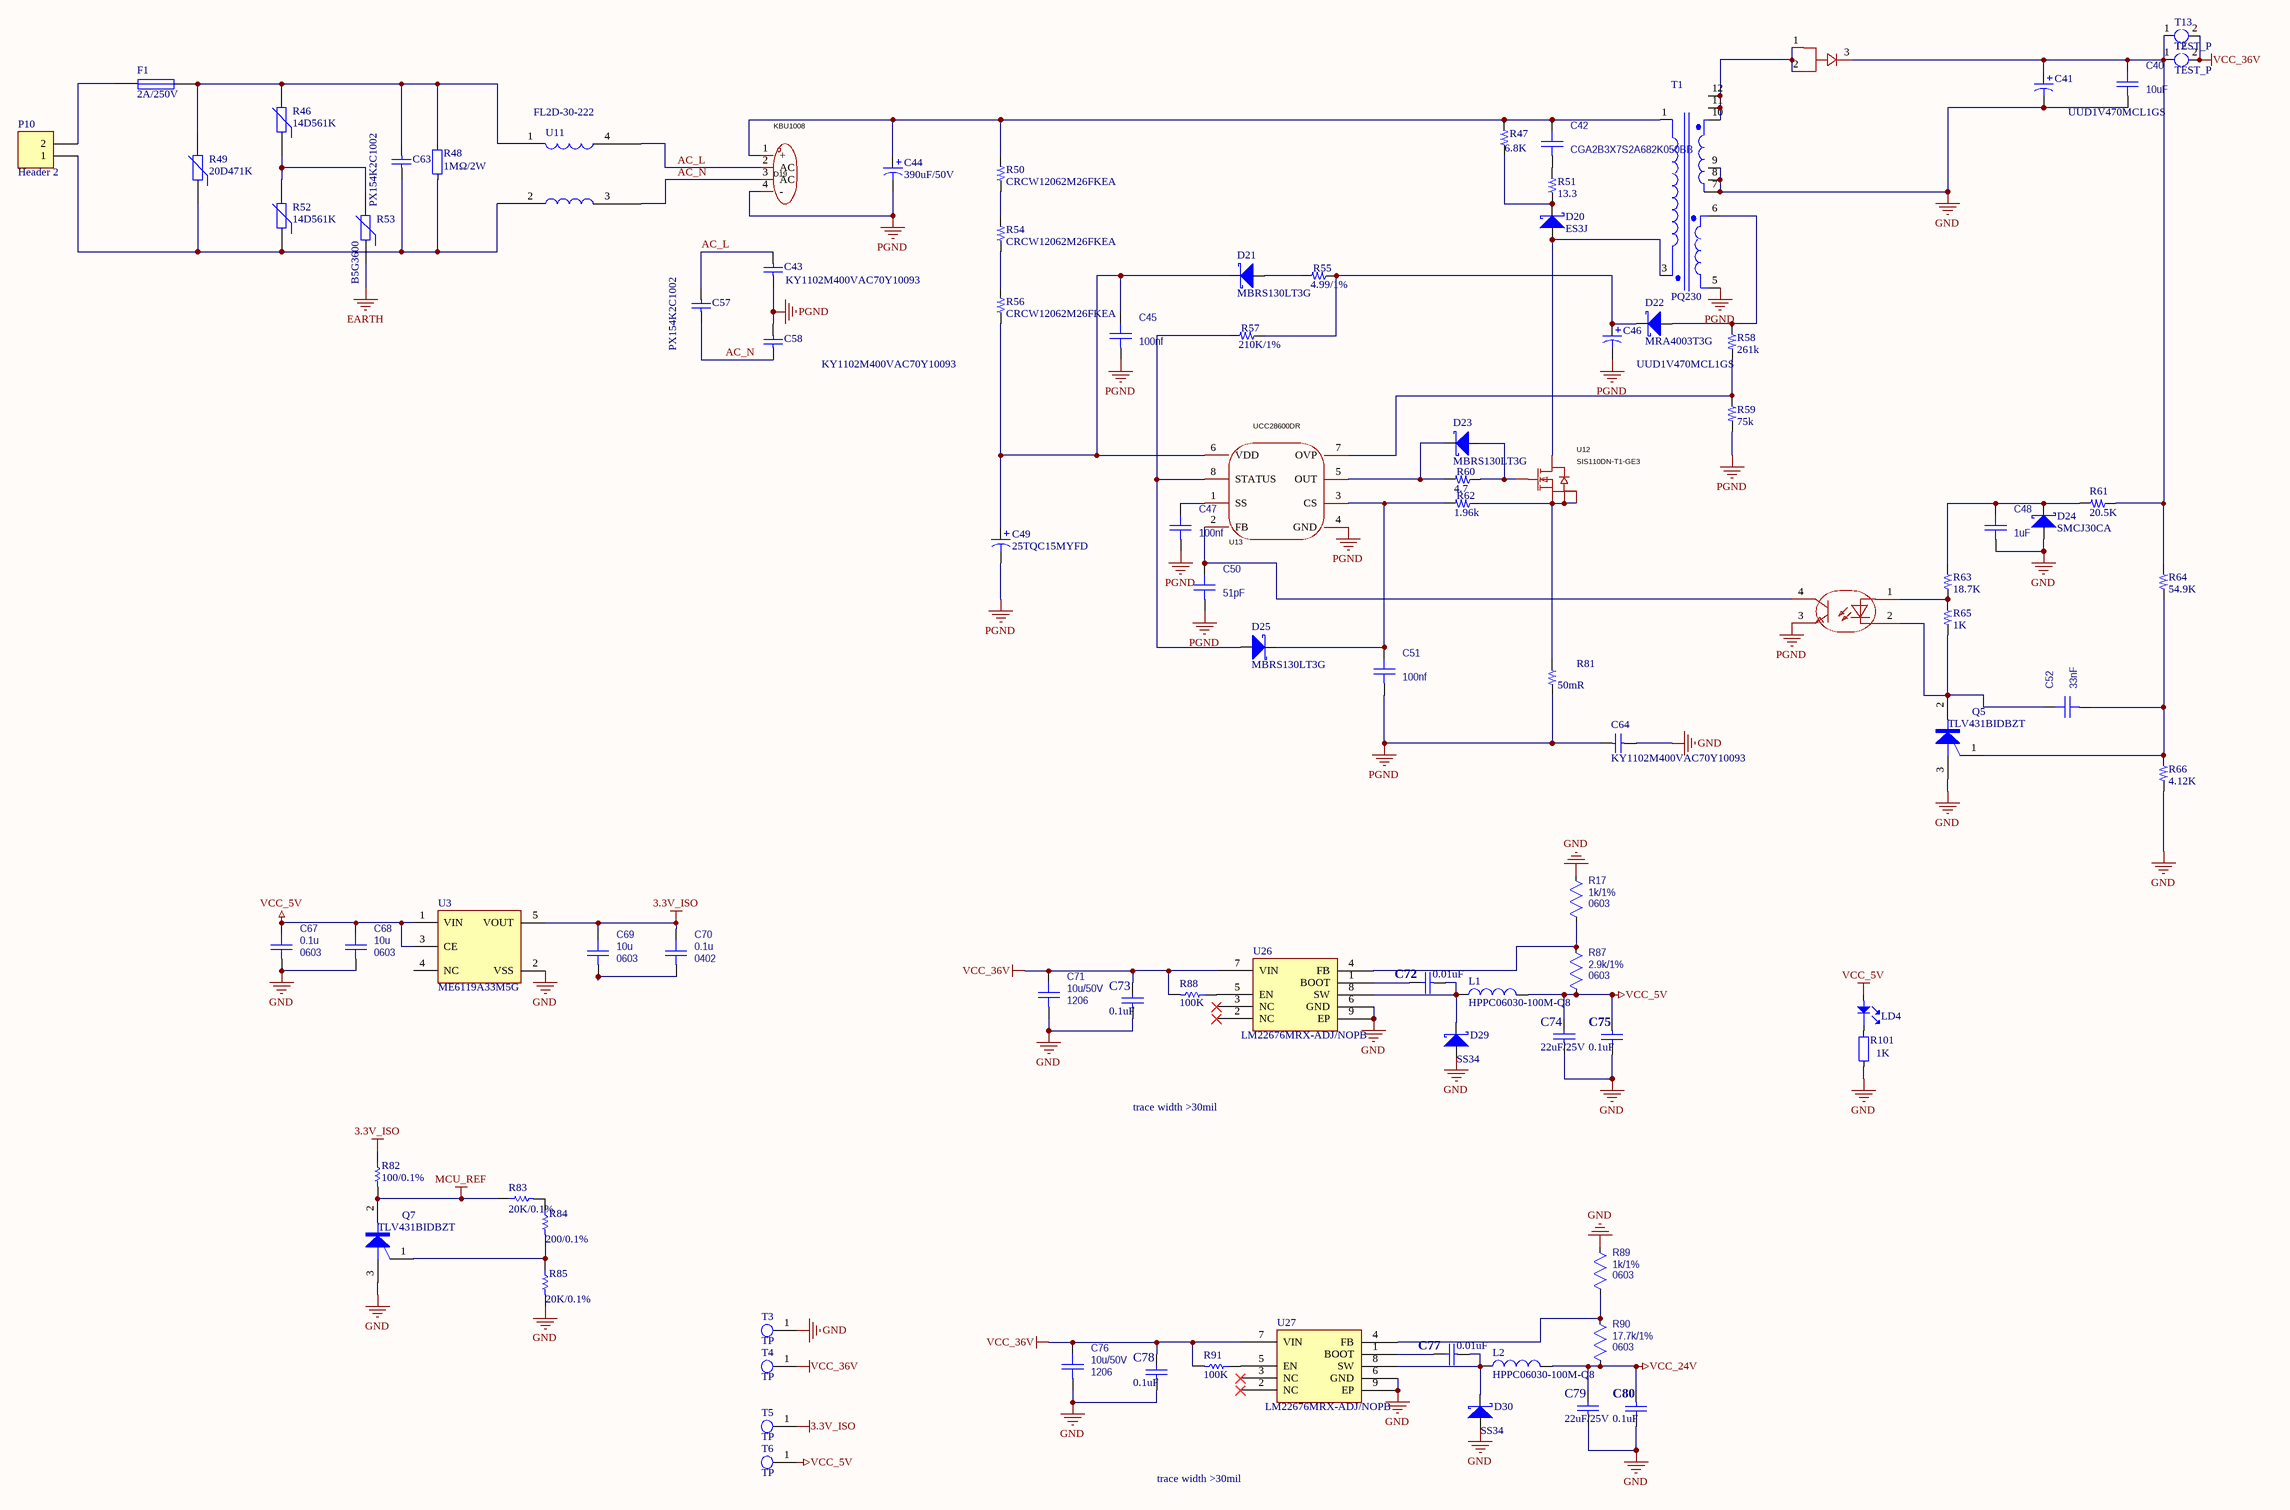
[diagram p4: power.SchDoc]

### Parts
C40  Package: 10uF  [0603c]  (hidden comment: Capacitor_0603)
C41  UUD1V470MCL1GS  [Φ10×10]
C42  Package: CGA2B3X7S2A682K050BB  [0402c]  (hidden comment: Capacitor_0603)
C43  KY1102M400VAC70Y10093  [CAP-TH_L7.5-W4.5-P10.00-D0.6]
C44  390uF/50V  [LGX2H391MELC50]
C45  Package: 100nf  [0603c]  (hidden comment: Capacitor_0603)
C46  UUD1V470MCL1GS  [Φ10×10]
C47  Package: 100nf  [0603c]  (hidden comment: Capacitor_0603)
C48  Package: 1uF  [0402c]  (hidden comment: Capacitor_0603)
C49  25TQC15MYFD  [7343]
C50  Package: 51pF  [0603c]  (hidden comment: Capacitor_0603)
C51  Package: 100nf  [0603c]  (hidden comment: Capacitor_0603)
C52  Package: 33nF  [0603c]  (hidden comment: Capacitor_0603)
C57  PX154K2C1002  [CAP-TH_L13.0-W6.0-P10.00-D0.6]
C58  KY1102M400VAC70Y10093  [CAP-TH_L7.5-W4.5-P10.00-D0.6]
C63  PX154K2C1002  [CAP-TH_L13.0-W6.0-P10.00-D0.6]
C64  KY1102M400VAC70Y10093  [CAP-TH_L7.5-W4.5-P10.00-D0.6]
C67  value 0.1u  Package: 0603  [CAPC1608X092N_0603]  (hidden comment: Capacitor_0603)
C68  value 10u  Package: 0603  [CAPC1608X092N_0603]  (hidden comment: Capacitor_0603)
C69  value 10u  Package: 0603  [CAPC1608X092N_0603]  (hidden comment: Capacitor_0603)
C70  value 0.1u  Package: 0402  [CAPC1005X056N_0402]  (hidden comment: Capacitor_0402)
C71  value 10u/50V  Package: 1206  [1206C]  (hidden comment: Capacitor_1206)
C72  0.01uF  [0603C]
C73  0.1uF  [0603C]
C74  22uF/25V  [1206C]
C75  0.1uF  [0603C]
C76  value 10u/50V  Package: 1206  [1206C]  (hidden comment: Capacitor_1206)
C77  0.01uF  [0603C]
C78  0.1uF  [0603C]
C79  22uF/25V  [1206C]
C80  0.1uF  [0603C]
D18  SVT12100VB_R2_00001  [TO-277B_3P-L6.1-W4.3-LS7.0-BR]  (value not drawn)
D19  KBU1008  [KBU_4P-L23.2-W6.8-P5.10]
D20  ES3J  [SMC]
D21  MBRS130LT3G  [SMB]
D22  MRA4003T3G  [SMA]
D23  MBRS130LT3G  [SMB]
D24  SMCJ30CA  [SMC]
D25  MBRS130LT3G  [SMB]
D29  SS34  [SMA]
D30  SS34  [SMA]
F1  2A/250V  [可视开关电源保险丝座]
L1  HPPC06030-100M-Q8  [IND-SMD-L7.3-W6]
L2  HPPC06030-100M-Q8  [IND-SMD-L7.3-W6]
LD4  LED_Green_19-217  [0603led]  (value not drawn)
P10  Header 2  [HDR1X2]
Q5  TLV431BIDBZT  [SOT23-3]
Q7  TLV431BIDBZT  [SOT23-3]
R17  value 1k/1%  Package: 0603  [0603R]  (hidden comment: Resistor_0603)
R46  14D561K  [14D561K]
R47  6.8K  [0603R]
R48  1MΩ/2W  [5x15.5]
R49  20D471K  [20D471K]
R50  CRCW12062M26FKEA  [1206R]
R51  13.3  [0603R]
R52  14D561K  [14D561K]
R53  B5G3600  [B5G3600]
R54  CRCW12062M26FKEA  [1206R]
R55  4.99/1%  [0603R]
R56  CRCW12062M26FKEA  [1206R]
R57  210K/1%  [0603R]
R58  261k  [0603R]
R59  75k  [0603R]
R60  4.7  [0603R]
R61  20.5K  [0603R]
R62  1.96k  [0603R]
R63  18.7K  [0603R]
R64  54.9K  [0603R]
R65  1K  [0603R]
R66  4.12K  [0603R]
R81  50mR  [2512R]
R82  100/0.1%  [0603R]
R83  value 20K/0.1%  [0603R]  (hidden comment: 1K/0.1%)
R84  value 200/0.1%  [0603R]  (hidden comment: 1K/0.1%)
R85  value 20K/0.1%  [0603R]  (hidden comment: 1K/0.1%)
R87  value 2.9k/1%  Package: 0603  [0603R]  (hidden comment: Resistor_0603)
R88  100K  [0603R]
R89  value 1k/1%  Package: 0603  [0603R]  (hidden comment: Resistor_0603)
R90  value 17.7k/1%  Package: 0603  [0603R]  (hidden comment: Resistor_0603)
R91  100K  [0603R]
R101  1K  [0603r]
T1  PQ230  [pq3230]
T2  TEST_P  [TEST_P]
T3  TP  [TPD]
T4  TP  [TPD]
T5  TP  [TPD]
T6  TP  [TPD]
T13  TEST_P  [TEST_P]
U3  ME6119A33M5G  [MCRN-SOT23-5_V]
U11  FL2D-30-222  [TY-100P]
U12  SIS110DN-T1-GE3  [DFN-8_L3.3-W3.3-P0.65-BL-2]
U13  UCC28600DR  [so-8]
U14  TCMT1107  [sop4]  (value not drawn)
U26  LM22676MRX-ADJ/NOPB  [SOP127P600X168_HS-8N]
U27  LM22676MRX-ADJ/NOPB  [SOP127P600X168_HS-8N]

### Nets
3.3V_ISO: C69.1 C70.1 R82.1 T5.1 U3.5(VOUT)
EARTH: R53.1
GND: C40.2 C41.2 C48.2 C64.1 C67.2 C68.2 C71.2 C73.1 C74.1 C75.2 C76.2 C78.1 C79.1 C80.2 D24.1(A) D29.1(A) D30.1(A) Q5.3(A) Q7.3(A) R17.2 R66.2 R85.2 R89.2 R101.2 T1.7(Pri-) T1.8(Pri-) T1.9(Pri-) T3.1 U3.2(VSS) U26.6(GND) U26.9(EP) U27.6(GND) U27.9(EP)
MCU_REF: Q7.2(K) R82.2 R83.1
PGND: C43.1 C44.2 C45.2 C46.2 C47.2 C49.2 C50.2 C51.2 C58.2 C64.2 D19.4(-) R59.2 R81.2 T1.5(Pri-) U13.4(GND) U14.3(EM)
VCC_5V: C67.1 C68.1 C74.2 C75.1 L1.2 LD4.1 R87.1 T6.1 U3.1(VIN) U3.3(CE)
VCC_24V: C79.2 C80.1 L2.2 R90.1
VCC_36V: C71.1 C73.2 C76.1 C78.2 R88.2 R91.2 T2.2 T4.1 T13.2 U26.7(VIN) U27.7(VIN)
AC_L: C43.2 C57.2 D19.2(AC) U11.4(L)
AC_N: C57.1 C58.1 D19.3(AC) U11.3
NetC40_1: C40.1 C41.1 D18.3 R61.1 R64.1 T2.1 T13.1
NetC42_1: C42.1 C44.1 D19.1(+) R47.2 R50.2 T1.1(Pri+)
NetC42_2: C42.2 R51.2
NetC45_1: C45.1 C49.1 D21.2(K) R56.1 U13.6(VDD)
NetC46_1: C46.1 D22.2(K) R55.1 R57.1
NetC47_1: C47.1 U13.1(SS)
NetC48_1: C48.1 D24.2(K) R61.2 R63.1
NetC50_1: C50.1 U13.2(FB) U14.4(COL)
NetC51_1: C51.1 D25.2(K) R62.2 U13.3(CS)
NetC52_1: C52.1 Q5.2(K) R65.2 U14.2(CAT)
NetC52_2: C52.2 Q5.1(G) R64.2 R66.1
NetC63_1: C63.1 P10.1 R48.2 R49.1 R52.1 U11.2(L)
NetC63_2: C63.2 F1.2 R46.2 R48.1 R49.2 U11.1(L)
NetC69_2: C69.2 C70.2
NetC72_1: C72.1 D29.2(K) L1.1 U26.8(SW)
NetC72_2: C72.2 U26.1(BOOT)
NetC77_1: C77.1 D30.2(K) L2.1 U27.8(SW)
NetC77_2: C77.2 U27.1(BOOT)
NetD18_1: D18.1 D18.2 T1.10(Pri+) T1.11(Pri+) T1.12(Pri+)
NetD20_1: D20.1(A) T1.3(Pri-) U12.5(D)
NetD20_2: D20.2(K) R47.1 R51.1
NetD21_1: D21.1(A) R55.2
NetD22_1: D22.1(A) R58.1 T1.6(Pri-)
NetD23_1: D23.1(A) R60.1 U12.4(G)
NetD23_2: D23.2(K) R60.2 U13.5(OUT)
NetD25_1: D25.1(A) R57.2 U13.8(STATUS)
NetF1_1: F1.1 P10.2
NetLD4_2: LD4.2 R101.1
NetQ7_1: Q7.1(G) R84.2 R85.1
NetR17_1: R17.1 R87.2 U26.4(FB)
NetR46_1: R46.1 R52.2 R53.2
NetR50_1: R50.1 R54.2
NetR54_1: R54.1 R56.2
NetR58_2: R58.2 R59.1 U13.7(OVP)
NetR62_1: R62.1 R81.1 U12.1(S) U12.2(S) U12.3(S)
NetR63_2: R63.2 R65.1 U14.1(AN)
NetR83_2: R83.2 R84.1
NetR88_1: R88.1 U26.5(EN)
NetR89_1: R89.1 R90.2 U27.4(FB)
NetR91_1: R91.1 U27.5(EN)

Not connected (* = marked no-connect by the designer): U3 4(NC); U26 2(NC)* 3(NC)*; U27 2(NC)* 3(NC)*

### Notes on the sheet
- trace width >30mil

### Library data of the parts
C40 C42 C45 C47 C48 C50-C52 C68 C69 = Capacitor_0603: as C7 on sheet mcu; Supplier 1: *; ComponentLink1URL: *; Supplier Part Number 1: *; ComponentLink1Description: Datasheet; SupplierDescription: CAP CER 10UF 10V X5R 0603
C41 C44 C46 C49 = Cap Pol1: Polarized Capacitor (Radial); Value: 220uF/50V; Published: 8-Jun-2000; LatestRevisionDate: 17-Jul-2002; LatestRevisionNote: Re-released for DXP Platform.; PackageReference: RB7.6-15; Publisher: Altium Limited
C43 C57 C58 C63 C64 = Cap: Capacitor; Value: 22nF; Published: 8-Jun-2000; LatestRevisionDate: 17-Jul-2002; LatestRevisionNote: Re-released for DXP Platform.; PackageReference: RAD-0.3; Publisher: Altium Limited; PackageDescription: Radial Cap, Thru-Hole; 2 Leads; 0.3 in Pin Spacing
C67 = Capacitor_0603: Capacitor, MLCC; Manufacturer: KEMET; PartNumber: C0603C104M5RACTU; Tolerance: [tol]; TempCo: [tempco]; Voltage Rating: [voltage]; ComponentLink1URL: *; Current Rating: *; ComponentLink1Description: Datasheet; Power Rating: *; SupplierDescription: CAP CER 0.1UF 50V X7R 0603
C70 = Capacitor_0402: Capacitor, MLCC; Manufacturer: Murata Electronics; PartNumber: GRM155R71C104KA88J; Tolerance: [tol]; TempCo: [tempco]; Voltage Rating: [voltage]; Supplier 1: *; ComponentLink1URL: *; Supplier Part Number 1: *; ComponentLink1Description: Datasheet; SupplierDescription: CAP CER 0.1UF 16V X7R 0402
C71 C76 = Capacitor_1206: PartNumber: C1206C106M3PACTU; Tolerance: [tol]; TempCo: [tempco]; Voltage Rating: [voltage]; Power Rating: *; SupplierDescription: CAP CER 10UF 25V X5R 1206
C72 C77 = CAP: Value: 0.01u/50V
C73 C75 C78 C80 = CAP: Value: 0.1uF/50V
C74 C79 = CAP: Value: 22uF/25V
D18 = SVT12100VB_R2_00001: Manufacturer: PANJIT(强茂); Add into BOM: yes; Forward Voltage (Vf@If): 670mV@12A; Reverse Voltage (Vr): 100V; Average Rectified Current (Io): 12A; Reverse Leakage Current (Ir): 100uA@100V; Symbol: SVT12100VB_R2_00001; Device: SVT12100VB_R2_00001; LCSC Part Name: 电压:100V 电流:12A; Supplier Part: C391735; Manufacturer Part: SVT12100VB_R2_00001; Supplier Footprint: TO-277B; JLCPCB Part Class: Extended Part; Datasheet: https://atta.szlcsc.com/upload/public/pdf/source/20191009/C391735_74715AF6864FC3D0E0C927F6D6BDC70E.pdf; Supplier: LCSC; Convert to PCB: yes
D19 = KBU1008: Manufacturer: YANGJIE(扬杰); Symbol: KBU1008-A2-0000; Add into BOM: yes; Forward Voltage (Vf@If): 1.1V@5A; Reverse Voltage (Vr): 800V; Average Rectified Current (Io): 10A; Reverse Leakage Current (Ir): 10uA@800V; Peak Forward Surge Current: 170A; Device: KBU1008; LCSC Part Name: 电压:800V 电流:10A; Supplier Part: C781391; Manufacturer Part: KBU1008; Supplier Footprint: KBU; JLCPCB Part Class: Extended Part; Datasheet: https://atta.szlcsc.com/upload/public/pdf/source/20200429/C525723_C60B0D61B4DEC997859D4E414530B852.pdf; Supplier: LCSC; Convert to PCB: yes; Operating Temperature: -55℃~+150℃@(Tj)
D20-D25 = DIODE S: Schottky Diode
D29 D30 = DIODE S: Value: SS34
F1 = Fuse 1: Fuse; Published: 8-Jun-2000; LatestRevisionDate: 17-Jul-2002; LatestRevisionNote: Re-released for DXP Platform.; PackageReference: PIN-W2/E2.8; Publisher: Altium Limited; PackageDescription: Thru-Hole; 2 Leads
L1 L2 = 1276AS-H-100M=P2: Rated Current: 250 mA; Mounting Technology: Surface Mount; PackageDescription: 2-Pin SMT Inductor, 3.2 x 2.5 mm Body; PackageReference: IND1210; PartNumber: 1276AS-H-100M=P2; Value: HPPC06030-100M-Q8
LD4 = LED_Green_19-217: as LD1 on sheet mcu; 规格型号(完整型号): 19-217/G7C-AN1P2/3T
P10 = Header 2: Header, 2-Pin; LatestRevisionDate: 17-Jul-2002; LatestRevisionNote: Re-released for DXP Platform.; Publisher: Altium Limited
Q5 Q7 = PUT: Programmable Unijunction Transistor; Published: 8-Jun-2000; LatestRevisionDate: 17-Jul-2002; LatestRevisionNote: Re-released for DXP Platform.; PackageReference: TO-52; Publisher: Altium Limited
R17 R87 R89 R90 = Resistor_0603: PartNumber: RC0603FR-1075KL; Power Rating: [power]; TempCo: [tempco]; Tolerance: tol; SupplierDescription: RES SMD 75K OHM 1% 1/10W 0603
R46 R49 R52 R53 = Res Varistor: Varistor (Voltage-Sensitive Resistor); Published: 24-Mar-1999; LatestRevisionDate: 29-May-2009; LatestRevisionNote: IPC-7351 Footprint Added.; PackageVersion: Mar-2003; PackageReference: 6-0805; Publisher: Altium Limited; PackageDescription: Chip Resistor 0805 Case Size; Code_IPC: RESC2012
R47 R50 R51 R54-R66 R81 = R
R48 = RES0603: 物料主编码(PN): 150000040; Value: 100K; ID: 233; 序号: 109; 物料名称: 贴片电阻; 精度: ±1%; 规格型号(完整型号): RC1608F103CS/RC0603FR-0710KL; 物料描述: RES,贴片电阻,0603,10k,±1%,1/10W,1.6X0.8X0.45mm,RC1608F103CS/RC0603FR-0710KL; 工作温度: –55°C to 155°C; 制造商: 三星/YAGEO; 器件等级: ——; 物料类型: 表贴电阻; 参数值: 1.00E+04
R82-R85 = Res1: Resistor; Published: 8-Jun-2000; LatestRevisionDate: 17-Jul-2002; LatestRevisionNote: Re-released for DXP Platform.; PackageReference: AXIAL-0.3; Publisher: Altium Limited
R88 R91 = Res1: Published: 8-Jun-2000; PackageReference: AXIAL-0.3; Publisher: Altium Limited; Value: 100K
R101 = RES0603: as R4 on sheet mcu; Value: 1K
U3 = ME6119C50M5G: High Speed LDO Regulators, Low ESR, 5.0 V, 400 mA, -40 to 125 degC, 5-Pin SOT-23, RoHS, Tape and Reel; Number of Regulators: 1; Dropout Voltage: 160mV; Output Current: 300mA; Min Input Voltage: 2.5V; Nominal Output Voltage: 3.3V; Max Input Voltage: 5.5V; Min Current Limit: 400mA; Number of Pins: 5; RoHSCompliant: True; Min Operating Temperature: -40degC; Case\/Package: SOT-23; Datasheet URL: http://ww1.microchip.com/downloads/en/DeviceDoc/MIC550X.pdf; Package Description: 5-Pin Small Outline Transistor, Body 1.6 x 2.9 mm, Pitch 0.95 mm; Max Operating Temperature: 125degC; Packaging: CutTape; Manufacturer URL: http://www.microchip.com/; Package Reference: SOT-23; Mount: SurfaceMount; Output Voltage: 3.3V; Mounting Technology: SurfaceMount; Lead Free: LeadFree; REACH SVHC: NoSVHC; Datasheet Version: Rev. 2.3, 04/2015
U11 = TY-100P: PCB mounting filters
U12 = SIS110DN-T1-GE3: Manufacturer: VISHAY(威世); Add into BOM: yes; Symbol: SIS110DN-T1-GE3; Device: SIS110DN-T1-GE3; LCSC Part Name: SIS110DN-T1-GE3; Supplier Part: C5334354; Manufacturer Part: SIS110DN-T1-GE3; Supplier Footprint: SO-8; JLCPCB Part Class: Extended Part; Datasheet: https://atta.szlcsc.com/upload/public/pdf/source/20221230/028E61738915F263ABF2615161A8D7B6.pdf; Supplier: LCSC; Convert to PCB: yes
U13 = UCC28600DR: Manufacturer: TI(德州仪器); Add into BOM: yes; Output Isolation: 隔离; Supply Voltage: 8V~21V; Switching Frequency: 40kHz~130kHz; Duty Cycle: 99%; Topology: 反激式; Symbol: UCC28600DR; Device: UCC28600DR; LCSC Part Name: UCC28600DR; Supplier Part: C28585; Manufacturer Part: UCC28600DR; Supplier Footprint: SOIC-8; JLCPCB Part Class: Extended Part; Datasheet: https://www.ti.com/cn/lit/gpn/ucc28600; Supplier: LCSC; Convert to PCB: yes; Operating Temperature: -40℃~+105℃@(Ta)
U14 = TCMT1107: Manufacturer: VISHAY(威世); Add into BOM: yes; Input voltage type: DC; Output Type: 光电三极管; Forward Voltage: 1.35V; Output Current: 50mA; Isolation Voltage(rms): 3.75kV; Reverse Voltage: 6V; Receiving End Voltage: 70V; Number of Outputs: 1; Collector-Emitter Saturation Voltage (Vce(sat)@Ic,IF): 300mV@1mA,10mA; Rise time: 5.5us@2mA,100Ω; Fall time: 7us@2mA,100Ω; Symbol: TCMT1107; Device: TCMT1107; LCSC Part Name: DC输入 隔离电压(rms):3750V; Supplier Part: C81148; Manufacturer Part: TCMT1107; Supplier Footprint: SOP-4-1.27mm; JLCPCB Part Class: Extended Part; Datasheet: https://atta.szlcsc.com/upload/public/pdf/source/20170713/C118299_1499918878383816727.pdf; Supplier: LCSC; Convert to PCB: yes; Operating Temperature: -40℃~+100℃
U26 U27 = LM22676MR-5.0: Value: LM22676MRE-5.0/NOPB

## Nets that join several sheets
3.3V_ISO: mcu (FB1.1 FB4.1 R3.1 R95.1), ai (FB2.1), DI_DO (14 pins), power (5 pins)
EARTH: mcu (J1.1), power (R53.1)
GND: mcu (39 pins), ai (R25.1), DI_DO (15 pins), sensor (P2.2 P3.2), power (33 pins)
MCU_REF: mcu (U1.28), power (Q7.2 R82.2 R83.1)
VCC_5V: mcu (LD1.1 LD2.1 LD3.1 P11.9), ai (C27.1 U6.1 U6.3), sensor (8 pins), power (10 pins)
DI_IN0: mcu (U1.56), DI_DO (R29.2 U8.16)
DI_IN1: mcu (U1.55), DI_DO (R33.2 U8.14)
DI_IN2: mcu (U1.57), DI_DO (R37.2 U8.12)
DI_IN3: mcu (U1.49), DI_DO (R41.2 U8.10)
DI_IN4: mcu (U1.48), DI_DO (R27.2 U7.16)
DI_IN5: mcu (U1.47), DI_DO (R31.2 U7.14)
DI_IN6: mcu (U1.33), DI_DO (P6.7 R35.2 U7.12)
DI_IN7: mcu (U1.34), DI_DO (P6.8 R99.2 U7.10)
DO_ctrl_0: mcu (U1.30), DI_DO (U9.2)
DO_ctrl_1: mcu (U1.2 U1.26), DI_DO (U10.2)
EXTPROC_RS485_DIRECTION: mcu (U1.24), DI_DO (R77.2 U24.2 U24.3)
EXTPROC_SPI2_ADC_CS3: mcu (U1.43), ai (U4.3)
EXTPROC_SPI2_MISO: mcu (U1.45), ai (U4.6)
EXTPROC_SPI2_MOSI: mcu (U1.46), ai (U4.4)
EXTPROC_SPI2_SCLK: mcu (U1.44), ai (U4.5)
MEA: mcu (U1.12), sensor (Q6.3 R24.2 S_RX.1)
MEB: mcu (U1.13), sensor (Q8.3 R38.2 S_RX1.1)
MEZ: mcu (U1.19), sensor (Q9.3 R39.2 S_RX2.1)
MHU: mcu (U1.53), sensor (Q10.3 R92.2 S_RX3.1)
MHV: mcu (U1.73), sensor (Q11.3 R93.2 S_RX4.1)
MHW: mcu (U1.68), sensor (Q12.3 R94.2 S_RX5.1)
uart1_rx: mcu (U1.23), DI_DO (R76.2)
uart1_tx: mcu (U1.22), DI_DO (U24.4)